# EAGLE design MiWi1 (EAGLE 6.2)
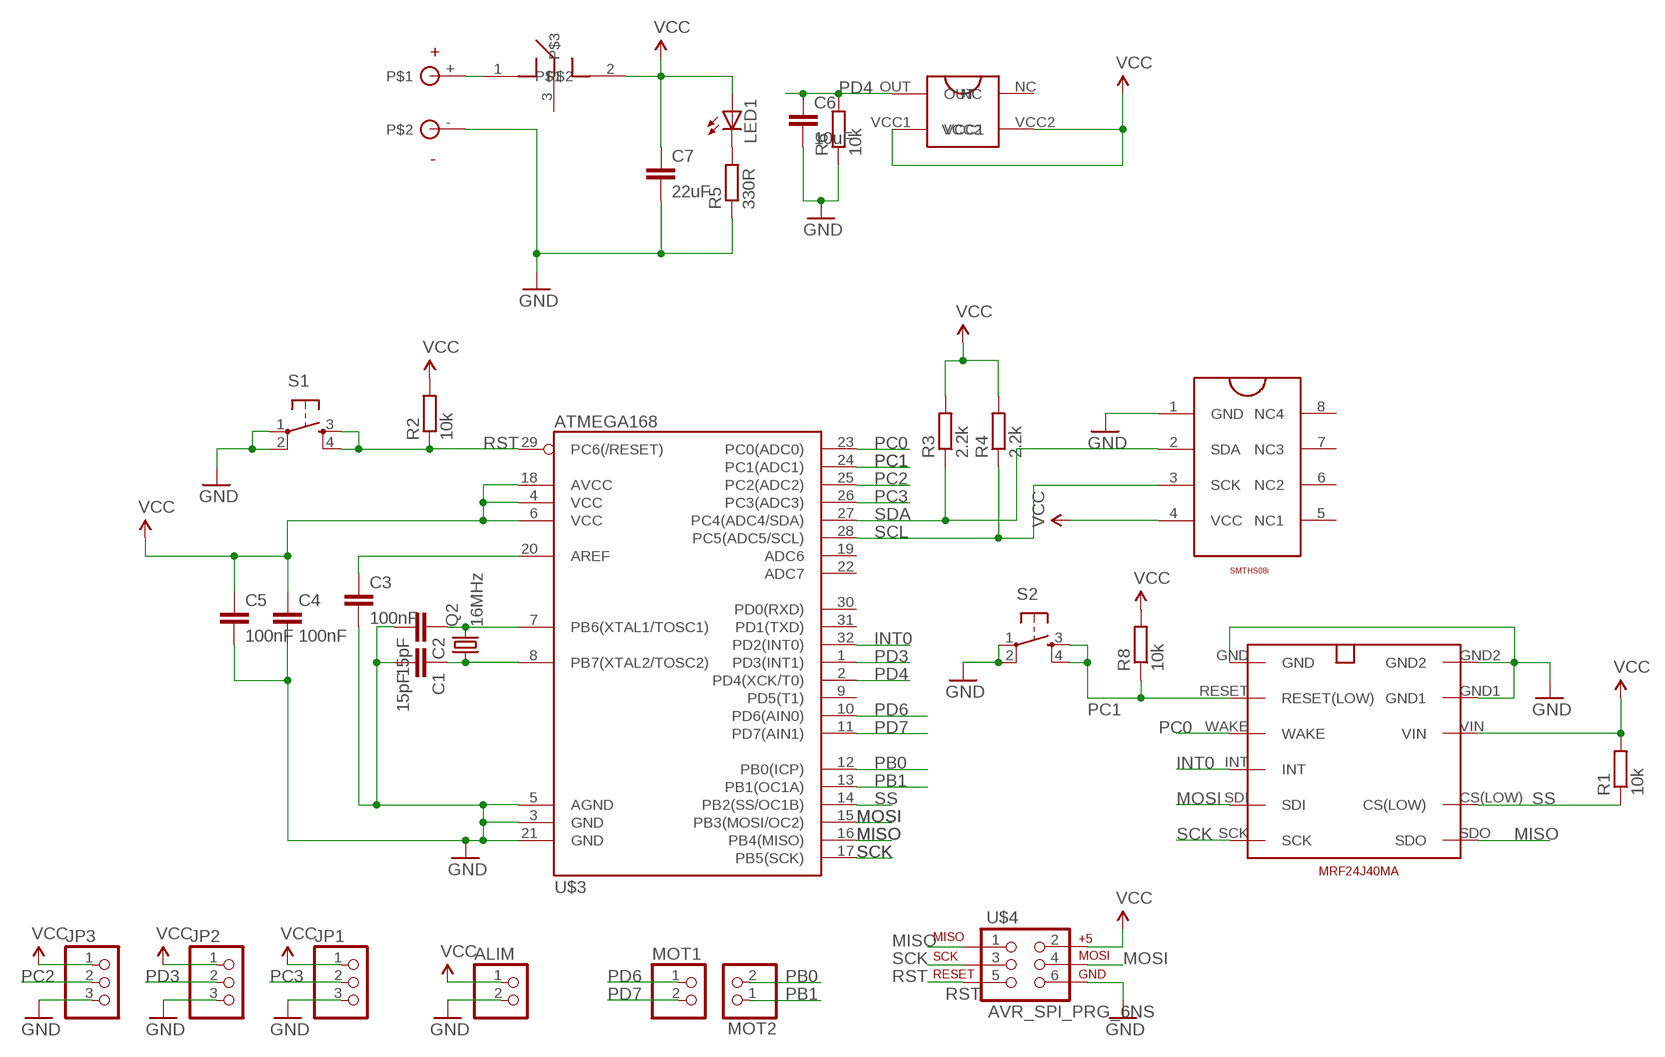
[diagram p0: schematic, sheet 1]

## Parts
ALIM  PINHD-1X2  [1X02]
C1  15pF  C-EUC0805  [C0805]
C2  15pF  C-EUC0805  [C0805]
C3  100nF  C-EUC0805  [C0805]
C4  100nF  C-EUC0805  [C0805]
C5  100nF  C-EUC0805  [C0805]
C6  10uF  C-EUC0805  [C0805]
C7  22uF  C-EUC0805  [C0805]
JP1  PINHD-1X3  [1X03]
JP2  PINHD-1X3  [1X03]
JP3  PINHD-1X3  [1X03]
LED1  LEDCHIP-LED0805  [CHIP-LED0805]
MOT1  PINHD-1X2  [1X02]
MOT2  PINHD-1X2  [1X02]
Q2  16MHz  CRYSTAL5X3  [CRYSTAL-SMD-5X3]
R1  10k  R-EU_R0805W  [R0805W]
R2  10k  R-EU_R0805W  [R0805W]
R3  2.2k  R-EU_R0805W  [R0805W]
R4  2.2k  R-EU_R0805W  [R0805W]
R5  330R  R-EU_R0805W  [R0805W]
R6  10k  R-EU_R0805W  [R0805W]
R8  10k  R-EU_R0805W  [R0805W]
S1  TAC_SWITCHSMD  [TACTILE_SWITCH_SMD]
S2  TAC_SWITCHSMD  [TACTILE_SWITCH_SMD]
U$1  MRF24J40MA  [MRF24J40MA]
U$2  SMTH08I  [SMTHS08I_PK]
U$3  ATMEGA168  [TQFP32-08]
U$4  AVR_SPI_PRG_6NS  [2X3-NS]
U$5  SPDT_PCM12SMRT  [SPDT_PCM12SMRT]
U$6  2XAAA_BATTERY_HOLDER  [2XAAA_BATTERY_HOLDER]
U$7  APDS-9004  [APDS-9004]

## Nets
GND: ALIM.2 C1.2 C2.2 C3.2 C4.2 C5.2 C6.2 C7.2 JP1.3 JP2.3 JP3.3 R5.1 R6.1 S1.1 S1.2 S2.1 S2.2 U$1.GND U$1.GND1 U$1.GND2 U$2.1(GND) U$3.3(GND) U$3.5(AGND) U$3.21(GND) U$4.6 U$6.-
INT0: U$1.INT U$3.32(PD2(INT0))
MISO: U$1.SDO U$3.16(PB4(MISO)) U$4.1
MOSI: U$1.SDI U$3.15(PB3(MOSI/OC2)) U$4.4
N$1: C2.1 Q2.3 U$3.7(PB6(XTAL1/TOSC1))
N$3: C1.1 Q2.1 U$3.8(PB7(XTAL2/TOSC2))
N$4: C3.1 U$3.20(AREF)
N$5: U$5.1 U$6.+
N$7: LED1.C R5.2
PB0: MOT2.2 U$3.12(PB0(ICP))
PB1: MOT2.1 U$3.13(PB1(OC1A))
PC0: U$1.WAKE U$3.23(PC0(ADC0))
PC1: R8.1 S2.3 S2.4 U$1.RESET(RESET(LOW)) U$3.24(PC1(ADC1))
PC2: JP3.2 U$3.25(PC2(ADC2))
PC3: JP1.2 U$3.26(PC3(ADC3))
PD3: JP2.2 U$3.1(PD3(INT1))
PD4: C6.1 R6.2 U$3.2(PD4(XCK/T0)) U$7.OUT
PD6: MOT1.1 U$3.10(PD6(AIN0))
PD7: MOT1.2 U$3.11(PD7(AIN1))
RST: R2.1 S1.3 S1.4 U$3.29(PC6(/RESET)) U$4.5
SCK: U$1.SCK U$3.17(PB5(SCK)) U$4.3
SCL: R4.1 U$2.3(SCK) U$3.28(PC5(ADC5/SCL))
SDA: R3.1 U$2.2(SDA) U$3.27(PC4(ADC4/SDA))
SS: R1.1 U$1.CS(LOW) U$3.14(PB2(SS/OC1B))
VCC: ALIM.1 C4.1 C5.1 C7.1 JP1.1 JP2.1 JP3.1 LED1.A R1.2 R2.2 R3.2 R4.2 R8.2 U$1.VIN U$2.4(VCC) U$3.4(VCC) U$3.6(VCC) U$3.18(AVCC) U$4.2 U$5.2 U$7.VCC1 U$7.VCC2
Unconnected: U$2.5(NC1) U$2.6(NC2) U$2.7(NC3) U$2.8(NC4) U$3.9(PD5(T1)) U$3.19(ADC6) U$3.22(ADC7) U$3.30(PD0(RXD)) U$3.31(PD1(TXD)) U$5.3 U$7.NC

## Library data of the parts
ALIM MOT1 MOT2 = pinhead:PINHD-1X2: PIN HEADER
C1-C7 = rcl:C-EU: CAPACITOR, European symbol
JP1-JP3 = pinhead:PINHD-1X3: PIN HEADER
LED1 = adafruit (2):LED: LED OSRAM: - CHIPLED LG R971, LG N971, LY N971, LG Q971, LY Q971, LO R971, LY R971 LH N974, LH R974 LS Q976, LO Q976, LY Q976 LO Q996 - Hyper CHIPLED LW Q18S LB Q993, LB Q99A, LB R99A - SideLED LS A670, LO A670, LY A670, LG A670, LP A670 LB A673, LV A673, LT A673, LW A673 LH A674 LY A675 LS A676, LA A676, LO A676, LY A676, LW A676 LS A679, LY A679, LG A679 - Hyper Micro SIDELED® LS Y876, LA Y876, LO Y876, LY Y876 LT Y87S - SmartLED LW L88C, LW L88S LB L89C, LB L89S, LG L890 LS L89K, LO L89K, LY L89K LS L896, LA L896, LO L896, LY L896 - TOPLED LS T670, LO T670, LY T670, LG T670, LP T670 LSG T670, LSP T670, LSY T670, LOP T670, LYG T670 LG T671, LOG T671, LSG T671 LB T673, LV T673, LT T673, LW T673 LH T674 LS T676, LA T676, LO T676, LY T676, LB T676, LH T676, LSB T676, LW T676 LB T67C, LV T67C, LT T67C, LS T67K, LO T67K, LY T67K, LW E67C LS E67B, LA E67B, LO E67B, LY E67B, LB E67C, LV E67C, LT E67C LW T67C LS T679, LY T679, LG T679 LS T770, LO T770, LY T770, LG T770, LP T770 LB T773, LV T773, LT T773, LW T773 LH T774 LS E675, LA E675, LY E675, LS T675 LS T776, LA T776, LO T776, LY T776, LB T776 LHGB T686 LT T68C, LB T68C - Hyper Mini TOPLED® LB M676 - Mini TOPLED Santana® LG M470 LS M47K, LO M47K, LY M47K Source: http://www.osram.convergy.de/
Q2 = SparkFun:CRYSTAL: Crystals Various standard crystals. Proven footprints. Spark Fun Electronics SKU : COM-00534
R1-R6 R8 = rcl:R-EU_: RESISTOR, European symbol
S1 S2 = SparkFun:TAC_SWITCH: Momentary Switch Button commonly used for reset or general input. Spark Fun Electronics SKU : COM-00097
U$1 = MRF24J40MA:MRF24J40MA
U$2 = smths08i:SMTH08I: SMTH08i sensor (humidity and temperature) Datasheet: http://www.sensorguys.com/pdfs/SMTH08IN.pdf
U$3 = SparkFun:ATMEGA168
U$4 = SparkFun:AVR_SPI_PRG_6: AVR ISP 6 Pin This is the reduced ISP connector for AVR programming. Common on Arduino. This footprint will take up less PCB space and can be used with a 10-pin to 6-pin adapter such as SKU: BOB-08508
U$5 = spdt_switch:SPDT_PCM12SMRT
U$6 = 2xaa_battery_holder:2XAAA_BATTERY_HOLDER
U$7 = APDS-9004:APDS-9004

## Board
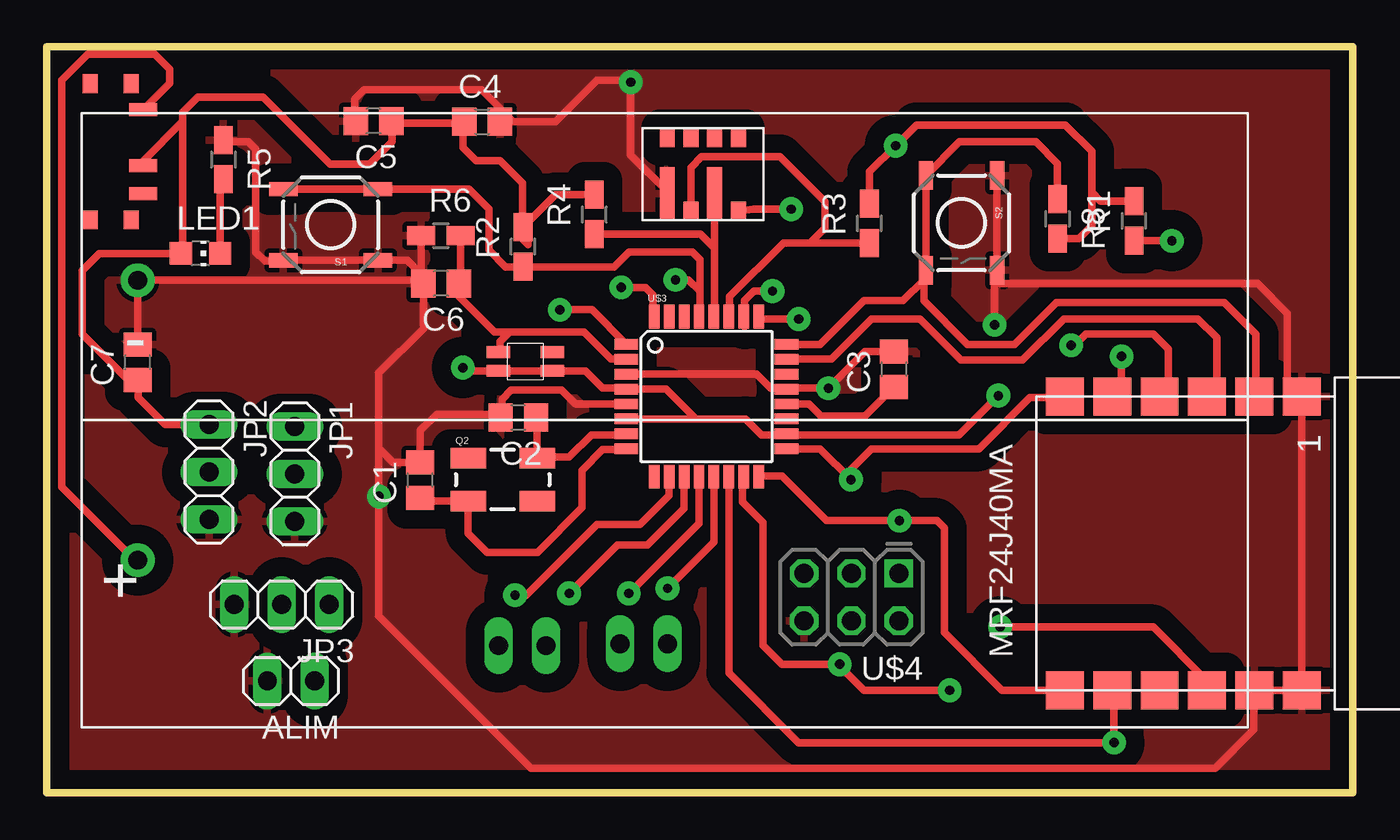
[diagram p1: board, top side]
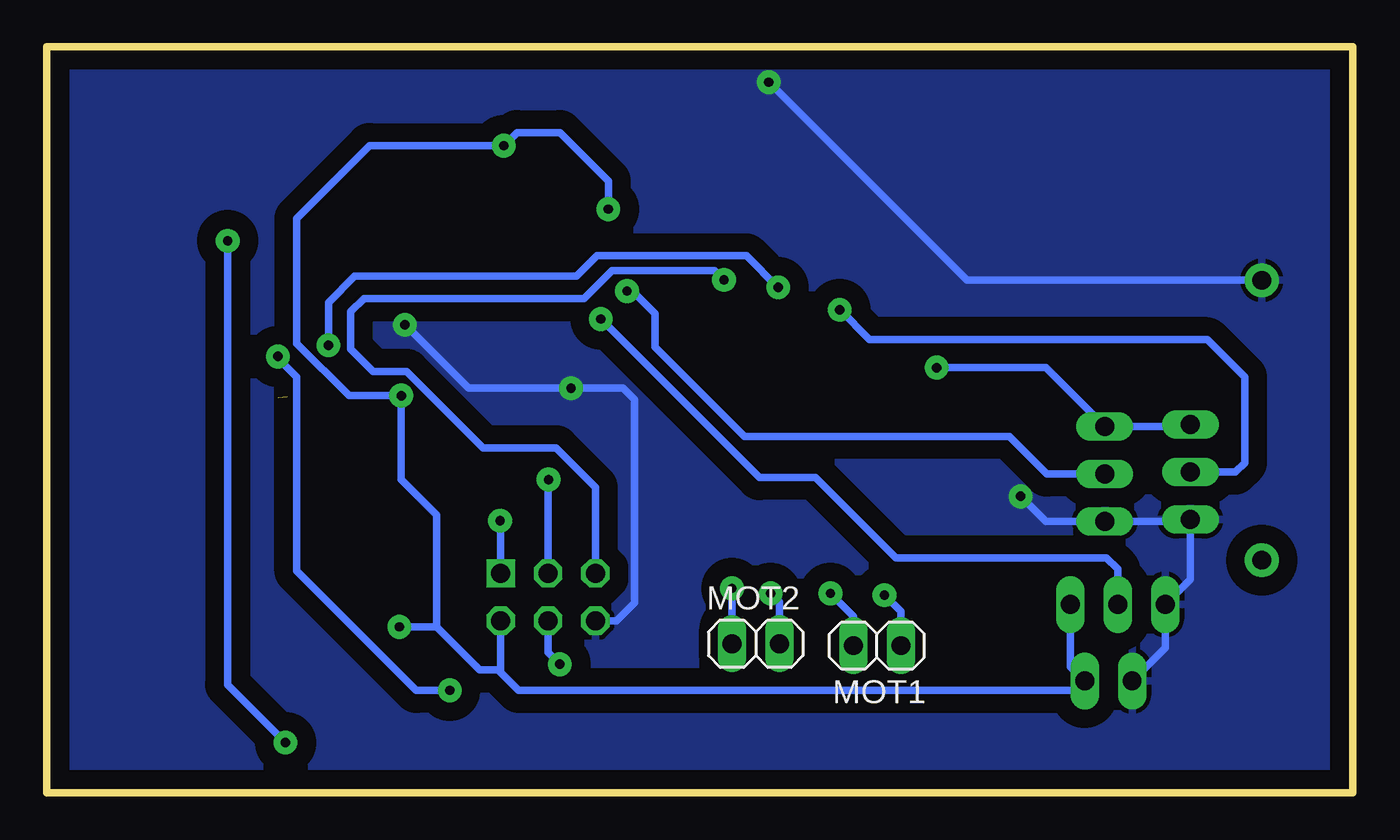
[diagram p2: board, bottom side, seen from below]

Size 70 x 40 mm. Coordinates in mm from the lower left corner, seen from the top.
Outline: 0,0 70,0 70,40 0,40 0,0
Copper layers (1*16): Top 0.035mm / dielectric 1.5mm / Bottom 0.035mm
Design rules: minimum track width 10mil, minimum drill 24mil, track to track 8mil, track to pad 8mil, pad to pad 8mil, via to via 8mil, smd to smd 8mil, copper to edge 40mil, drill to drill 8mil, minimum pad ring 10mil, minimum via ring 8mil, stop-mask expansion 4mil, vias tented up to drill 0mil, thermal gap 10mil

### Footprints (pad centres in the part's own frame; a part is rotated, then mirrored left to right if it is on the bottom)
1X02 = drill 1.016 long: 1 -1.27,0; 2 1.27,0
C0805 = smd 1.3 x 1.5: 1 -0.95,0; 2 0.95,0
1X03 = drill 1.016 long: 1 -2.54,0; 2 0,0; 3 2.54,0
CHIP-LED0805 = smd 1.2 x 1.2: A 0,-1.05; C 0,1.05
CRYSTAL-SMD-5X3 = smd 1.9 x 1.1: 1 -1.85,-1.15; 2 1.85,-1.15; 3 1.85,1.15; 4 -1.85,1.15
R0805W = smd 1.5 x 1: 1 -1.052,0; 2 1.052,0
TACTILE_SWITCH_SMD = smd 1.524 x 0.762: 1 -2.54,1.905; 2 2.54,1.905; 3 -2.54,-1.905; 4 2.54,-1.905
MRF24J40MA = smd 2.032 x 2.032: CS(LOW) 15.748,4.064; GND 0,14.224; GND1 15.748,11.684; GND2 15.748,14.224; INT 0,6.604; NC 15.748,6.604; RESET 0,11.684; SCK 0,1.524; SDI 0,4.064; SDO 15.748,1.524; VIN 15.748,9.144; WAKE 0,9.144
SMTHS08I_PK = smd 2.85 x 0.8: 1 1.425,5.16; 3 1.425,2.62 | smd 1 x 0.8: 2 0.5,3.89; 4 0.5,1.35; 5 4.43,1.35; 6 4.43,2.62; 7 4.43,3.89; 8 4.43,5.16
TQFP32-08 = smd 1.27 x 0.559: 1 -4.293,2.8; 2 -4.293,2; 3 -4.293,1.2; 4 -4.293,0.4; 5 -4.293,-0.4; 6 -4.293,-1.2; 7 -4.293,-2; 8 -4.293,-2.8; 17 4.293,-2.8; 18 4.293,-2; 19 4.293,-1.2; 20 4.293,-0.4; 21 4.293,0.4; 22 4.293,1.2; 23 4.293,2; 24 4.293,2.8 | smd 0.559 x 1.27: 9 -2.8,-4.293; 10 -2,-4.293; 11 -1.2,-4.293; 12 -0.4,-4.293; 13 0.4,-4.293; 14 1.2,-4.293; 15 2,-4.293; 16 2.8,-4.293; 25 2.8,4.293; 26 2,4.293; 27 1.2,4.293; 28 0.4,4.293; 29 -0.4,4.293; 30 -1.2,4.293; 31 -2,4.293; 32 -2.8,4.293
2X3-NS = drill 1.016 square: 1 -2.54,-1.27 | drill 1.016 octagon: 2 -2.54,1.27; 3 0,-1.27; 4 0,1.27; 5 2.54,-1.27; 6 2.54,1.27
SPDT_PCM12SMRT = smd 0.7 x 1.5: 1 -2.25,1.75; 2 0.75,1.75; 3 2.25,1.75 | smd 1 x 0.8: P$4 3.65,-1.1; P$7 3.65,1.1; P$8 -3.65,1.1; P$9 -3.65,-1.1
2XAAA_BATTERY_HOLDER = drill 1 pad 1.8: + 0,-7.5; - 0,7.5
APDS-9004 = smd 0.635 x 1.27: NC -2.7,-1.9; OUT -2.7,1; VCC1 -3.7,1; VCC2 -3.7,-1.9

### Placement (x,y rotation side)
ALIM  13.1,6 180 top
C1  20.02,16.77 90 top
C2  25.28,20.12 180 top
C3  45.41,22.71 90 top
C4  23.34,35.98 0 top
C5  17.52,36.02 180 top
C6  21.14,27.31 180 top
C7  4.88,23.09 90 top
JP1  13.3,17.1 270 top
JP2  8.7,17.2 270 top
JP3  12.6,10.1 180 top
LED1  8.25,28.92 270 top
MOT1  25.5,7.9 180 bottom
MOT2  32,8 0 bottom
Q2  24.44,16.8 0 top
R1  58.27,30.67 90 top
R2  25.53,29.28 90 top
R3  44.09,30.53 90 top
R4  29.35,31.01 90 top
R5  9.47,33.95 270 top
R6  21.13,29.88 0 top
R8  54.17,30.77 270 top
S1  15.22,30.46 180 top
S2  49.03,30.56 270 top
U$1  53.04,21.25 270 top
U$2  38.42,30.7 90 top
U$3  35.36,21.25 0 top
U$4  43.13,10.5 180 top
U$5  3.43,34.37 270 top
U$6  4.88,19.98 0 top
U$7  25.2,26.33 90 top

### Tracks (layer width: path | path; a pad name or v marks a point on that pad's centre or on a via)
GND  (via drill 0.5 pad 1.27)
  Top 0.406: U$3.3 38.05,22.45 38.8,21.7 39.6,21.7 | 39.6,21.7 U$3.21 | S2.2 50.94,28.6 | 50.94,28.6 S2.1 | 39.6,21.7 v41.9,21.7 43.86,23.66 C3.2 | S2.2 50.9,27.98 50.9,27.5 51.1,27.3 64.9,27.3 66.5,25.7 66.5,22.02 U$1.GND U$1.GND2 U$1.GND1 64.7,5.48 64.7,3.4 62.64,1.34 25.96,1.34 17.8,9.5 v17.8,15.9 17.8,18.5 | 50.8,28.46 50.94,28.6 | v50.8,25.1 50.8,27.89 S2.2 | S1.2 13.2,28.55 | 13.2,28.55 S1.1 19.32,28.55 20.08,27.8 | U$2.1 33.26,32.24 31.3,34.2 v31.3,38.1 31.2,38.2 29.5,38.2 27.28,35.98 24.9,35.98 | C7.2 U$6.- 20.02,27.48 | U$3.5 28.35,20.85 27.6,21.6 24.9,21.6 24.4,21.1 24.4,20.19 C2.2 24.15,20.3 20.9,20.3 20.02,19.42 C1.2 18.58,17.72 17.8,18.5 | 17.8,18.5 17.8,22.51 20.19,24.9 C6.2 20.02,27.48 | 20.02,27.48 20.08,27.54 20.08,27.8 | 20.08,27.8 R6.1 | R5.1 9.57,34.9 10.8,34.9 11.2,34.5 11.2,29 11.7,28.5 13.14,28.5 13.2,28.55 | C4.2 24.9,35.98 | 24.9,35.98 24.9,36.1 23.3,37.7 17,37.7 16.5,37.2 16.5,36.09 C5.2
  Bottom 0.406: U$4.6 39.47,9.23 38.5,10.2 38.5,21.1 39.1,21.7 v41.9,21.7 47.4,21.7 v50.8,25.1 | v17.8,15.9 16.46,14.56 JP1.3 8.8,14.56 JP2.3 8.7,11.46 JP3.3 10.06,7.77 ALIM.2 | v31.3,38.1 20.68,27.48 U$6.-
  pour Bottom (isolate 1): -2.9,42.9 -2.9,-0.9 -0.1,-3.7 70,-3.7 75.6,1.9 75.6,39.8 71.5,43.9 -1.9,43.9
  pour Top (isolate 1): -1.8,41.1 -1.8,0.2 1.1,-2.7 70.3,-2.7 73.9,0.9 73.9,38.6 70.4,42.1 -0.8,42.1
INT0  (via drill 0.5 pad 1.27)
  Top 0.406: 59.6,21.29 U$1.INT 60.1,21.71 60.1,23.8 59.3,24.6 55.7,24.6 55.1,24 v54.9,24 | v30.8,27.1 32.1,27.1 32.5,26.7 32.5,25.6 U$3.32
  Bottom 0.406: v30.8,27.1 32.5,28.8 40.5,28.8 41.6,27.7 53.5,27.7 54.9,26.3 v54.9,24
MISO  (via drill 0.5 pad 1.27)
  Top 0.406: U$1.SDO 51.2,5.5 48.1,8.6 48.1,14.2 47.7,14.6 v45.7,14.6 41.8,14.6 39.4,17 38.2,17 U$3.16
  Bottom 0.406: U$4.1 45.67,14.57 v45.7,14.6
MOSI  (via drill 0.5 pad 1.27)  (1 unrouted)
  Top 0.406: U$3.15 37.3,16.9 37.3,15.6 38.4,14.5 38.4,7.9 39.4,6.9 v42.5,6.9 42.5,6.8 43.8,5.5 v48.4,5.5 | 57.6,21.75 U$1.SDI | v57.6,23.4 57.6,21.2
  Bottom 0.406: U$4.4 43.13,7.53 v42.5,6.9 | v48.4,5.5 50.2,5.5 56.6,11.9 56.6,22.3 57.6,23.3 v57.6,23.4
N$1
  Top 0.406: U$3.7 31.02,19.2 29.2,19.2 28,18 26.34,18 Q2.3 26.29,20.06 C2.1
N$3
  Top 0.406: U$3.8 31.02,18.4 29.8,18.4 28.7,17.3 28.7,15.3 26.3,12.9 23.6,12.9 22.59,13.91 Q2.1 | Q2.1 | Q2.1 20.19,15.65 C1.1
N$4
  Top 0.406: U$3.20 40.85,20.85 41.5,20.2 43.85,20.2 C3.1
N$5
  Top 0.406: U$5.1 6.6,38.04 6.6,38.8 5.8,39.6 2.2,39.6 0.8,38.2 0.8,16.4 4.72,12.48 U$6.+
N$6  (via drill 1.5 pad 2.54)  (1 unrouted)
  other vias: -10,50 -10,-10
N$7
  Top 0.406: LED1.C 9.3,32.73 R5.2
N$8  (via drill 1.5 pad 2.54)
  other vias: 80,50
N$9  (via drill 1.5 pad 2.54)
  other vias: 80,-10
PB0  (via drill 0.5 pad 1.27)
  Top 0.406: U$3.12 34.96,14.46 v31.2,10.7
  Bottom 0.406: v31.2,10.7 30.73,10.23 MOT2.2
PB1  (via drill 0.5 pad 1.27)
  Top 0.406: U$3.13 35.76,13.46 v33.27,10.97
  Bottom 0.406: v33.27,10.97 MOT2.1
PC0
  Top 0.406: 62.3,21.27 U$1.WAKE 62.7,21.77 62.7,24.4 61.7,25.4 54.5,25.4 52.3,23.2 49,23.2 46.8,25.4 44.2,25.4 42.05,23.25 U$3.23
PC1
  Top 0.406: U$1.RESET 64.8,21.27 64.8,24.6 63.1,26.3 54.1,26.3 51.85,24.05 49.35,24.05 47,26.4 47,27.5 | 47.1,28 S2.4 | S2.4 S2.3 48.92,34.9 53,34.9 54.17,33.73 R8.1 | 47,27.5 47,27.89 S2.4 | U$3.24 41.45,24.05 43.8,26.4 45.9,26.4 47,27.5
PC2  (via drill 0.5 pad 1.27)
  Top 0.406: v40.3,25.4 38.3,25.4 U$3.25
  Bottom 0.406: JP3.2 12.6,12 13.2,12.6 24.5,12.6 28.8,16.9 31.8,16.9 v40.3,25.4
PC3  (via drill 0.5 pad 1.27)
  Top 0.406: 37.4,25 37.4,25.5 U$3.26 37.4,25.58 37.4,26.4 37.9,26.9 v38.9,26.9
  Bottom 0.406: JP1.2 16.4,17.1 18.4,19.1 32.6,19.1 37.4,23.9 37.4,25.7 38.6,26.9 v38.9,26.9
PD3  (via drill 0.5 pad 1.27)
  Top 0.406: U$3.1 29.22,25.9 v27.5,25.9
  Bottom 0.406: JP2.2 6.3,17.2 5.8,17.7 5.8,22.3 7.8,24.3 25.9,24.3 v27.5,25.9
PD4
  Top 0.406: U$3.2 30.25,23.25 28.8,24.7 24.8,24.7 | 24.8,24.7 24.3,24.2 24.3,23.73 U$7.OUT | 24.8,24.7 24,24.7 22.09,26.61 C6.1 22.18,27.4 R6.2
PD6  (via drill 0.5 pad 1.27)
  Top 0.406: 33.4,16.92 U$3.10 33.36,15.96 31.8,14.4 29.5,14.4 25.7,10.6 v25.1,10.6
  Bottom 0.406: v25.1,10.6 24.23,9.73 MOT1.1
PD7  (via drill 0.5 pad 1.27)
  Top 0.406: U$3.11 34.16,15.26 32.2,13.3 30.6,13.3 v28,10.7
  Bottom 0.406: v28,10.7 26.77,9.47 MOT1.2
RST  (via drill 0.5 pad 1.27)
  Top 0.406: S1.4 S1.3 22.64,32.37 23.7,31.3 23.7,29.1 24.6,28.2 25.56,28.2 | 25.56,28.2 R2.1 25.5,28.2 | 25.56,28.2 30.4,28.2 31.2,29 34.6,29 35,28.6 35,26.9 | 35,26.9 35,25.58 U$3.29 | v33.7,27.5 34.4,27.5 35,26.9
  Bottom 0.406: U$4.5 40.59,16.39 42.7,18.5 46.6,18.5 50.7,22.6 52.5,22.6 53.7,23.8 53.7,25.8 53,26.5 41.2,26.5 39.7,28 34.2,28 v33.7,27.5
SCK  (via drill 0.5 pad 1.27)
  Top 0.406: U$1.SCK 54.51,21.2 52.7,21.2 49.95,18.45 44.2,18.45 43.1,17.35 v43.1,16.8 41.45,18.45 U$3.17
  Bottom 0.406: U$4.3 43.13,16.77 v43.1,16.8
SCL
  Top 0.406: U$2.3 35.8,29.2 | 35.8,29.2 35.8,25.58 U$3.28 | R4.1 35.04,29.96 35.8,29.2
SDA
  Top 0.406: U$3.27 36.6,25.58 36.6,26.6 39.48,29.48 40.9,29.48 | R3.1 40.9,29.48 | 40.9,29.48 41.7,30.28 41.7,31.7 39.3,34.1 35.1,34.1 34.53,33.53 U$2.2
SS  (via drill 0.5 pad 1.27)
  Top 0.406: U$3.14 36.56,6.44 40.3,2.7 v57.2,2.7 57.2,5.41 U$1.CS(LOW) 57,5.61 57,6 57.1,5.9 | R1.1 60.28,29.62 v60.3,29.6
  Bottom 0.406: v60.3,29.6 60.3,5.8 v57.2,2.7
VCC  (via drill 0.5 pad 1.27)
  Top 0.406: U$3.6 34.8,20.05 | 34.8,20.05 37.45,20.05 38.3,19.2 39.6,19.2 U$3.18 39.7,19.2 48.9,19.2 v51,21.3 | 34.8,20.05 33.2,21.65 U$3.4 31.02,21.7 29.8,21.7 28.87,22.63 U$7.VCC2 U$7.VCC1 22.47,22.63 v22.3,22.8 | U$1.VIN 62.18,6.02 59.3,8.9 v51.1,8.9 | R8.2 55.32,29.72 56,30.4 56,32.2 | 56,32.2 56,34.4 54.6,35.8 46.6,35.8 v45.5,34.7 44.1,33.3 44.1,31.59 R3.2 | R1.2 56.48,31.72 56,32.2 | U$2.4 37.87,31.3 v39.9,31.3 | JP2.1 6.36,19.74 4.9,21.2 4.9,21.6 | 4.9,21.6 4.9,22.12 C7.1 | 4.9,21.6 1.9,24.6 1.9,28 2.82,28.92 LED1.A 7.3,29.02 7.3,36 | 29.4,32.6 29.4,32.06 R4.2 27.26,32.06 R2.2 25.8,30.06 25.8,29.4 25.5,29.7 25.5,32.7 24.3,33.9 23,33.9 22.31,34.59 22.31,35.9 | 7.3,36 7.3,36.5 8.1,37.3 11.6,37.3 15.2,33.7 17.3,33.7 18.5,34.9 18.5,35.99 C5.1 18.68,36.02 18.8,35.9 22.31,35.9 | U$5.2 5.18,33.88 7.3,36 | 22.31,35.9 C4.1
  Bottom 0.406: U$4.2 45.67,6.63 45.7,6.6 | 45.7,6.6 46.8,6.6 49.1,8.9 | 49.1,8.9 49.1,14.9 51,16.8 v51,21.3 53.8,21.3 56.6,24.1 56.6,30.8 52.7,34.7 v45.5,34.7 44.8,35.4 42.5,35.4 39.9,32.8 v39.9,31.3 | JP2.1 8.8,19.64 JP1.1 16.46,22.8 v22.3,22.8 | JP3.1 15.14,6.77 ALIM.1 14.87,5.5 44.7,5.5 45.7,6.5 45.7,6.6 | v51.1,8.9 49.1,8.9